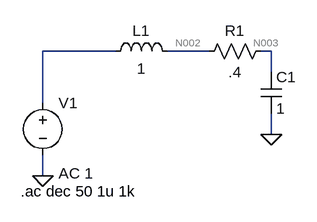
[diagram p0: schematic Draft3.asc]
Draft3.asc, the LTspice schematic file:
Version 4
SHEET 1 880 680
WIRE 48 96 -64 96
WIRE 192 96 128 96
WIRE 288 96 272 96
WIRE 288 128 288 96
WIRE -64 176 -64 96
WIRE 288 224 288 192
WIRE -64 288 -64 256
FLAG 288 224 0
FLAG -64 288 0
SYMBOL ind 32 112 R270
WINDOW 0 32 56 VTop 2
WINDOW 3 5 56 VBottom 2
SYMATTR InstName L1
SYMATTR Value 1
SYMBOL cap 272 128 R0
SYMATTR InstName C1
SYMATTR Value 1
SYMBOL res 288 80 R90
WINDOW 0 0 56 VBottom 2
WINDOW 3 32 56 VTop 2
SYMATTR InstName R1
SYMATTR Value .4
SYMBOL voltage -64 160 R0
WINDOW 123 24 124 Left 2
WINDOW 39 0 0 Left 0
SYMATTR InstName V1
SYMATTR Value ""
SYMATTR Value2 AC 1
TEXT -98 312 Left 2 !.ac dec 50 1u 1k

The netlist it stands for:
* Draft3.asc
L1 N001 N002 1
C1 N003 0 1
R1 N003 N002 .4
V1 N001 0 AC 1
.ac dec 50 1u 1k
.backanno
.end

* Results of the author's LTspice run, read from the files saved beside the schematic
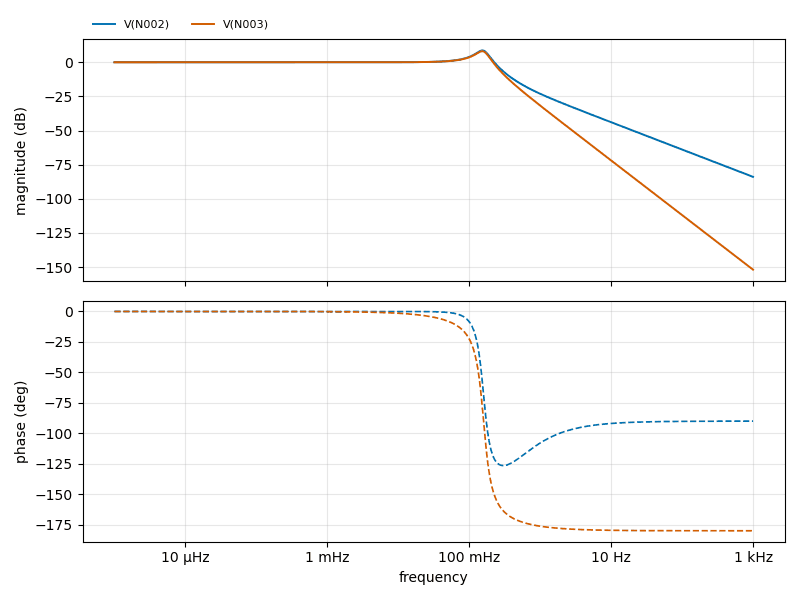
[diagram p1: AC Analysis of Draft3.asc, plotted from the saved traces]
* AC Analysis, 1 run:
*   V(N002): 0.00 dB at 1 µHz, -83.92 dB at 1 kHz, peak 8.70 dB at 151.4 mHz, 3 dB below the peak at 117.6 mHz and 183.9 mHz
*   V(N003): 0.00 dB at 1 µHz, -151.93 dB at 1 kHz, peak 8.11 dB at 151.4 mHz, 3 dB below the peak at 115.4 mHz and 182.4 mHz